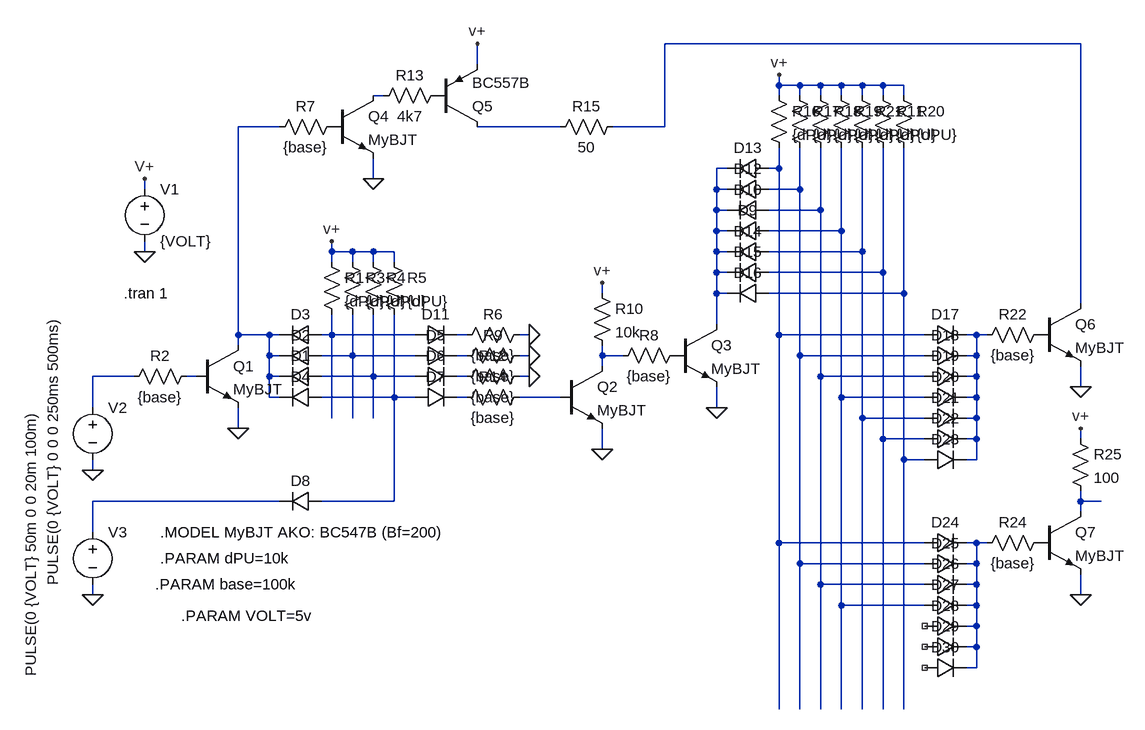
[diagram p0: schematic LoadTest.asc]
LoadTest.asc, the LTspice schematic file:
Version 4
SHEET 1 1704 1188
WIRE 1664 -224 1024 -224
WIRE 736 -192 736 -224
WIRE 1200 -160 1200 -176
WIRE 1232 -160 1200 -160
WIRE 1264 -160 1232 -160
WIRE 1296 -160 1264 -160
WIRE 1328 -160 1296 -160
WIRE 1360 -160 1328 -160
WIRE 1392 -160 1360 -160
WIRE 592 -144 576 -144
WIRE 1200 -144 1200 -160
WIRE 1232 -144 1232 -160
WIRE 1264 -144 1264 -160
WIRE 1296 -144 1296 -160
WIRE 1328 -144 1328 -160
WIRE 1360 -144 1360 -160
WIRE 1392 -144 1392 -160
WIRE 432 -96 368 -96
WIRE 864 -96 736 -96
WIRE 1024 -96 1024 -224
WIRE 1024 -96 944 -96
WIRE 1120 -32 1104 -32
WIRE 1200 -32 1200 -64
WIRE 1200 -32 1184 -32
WIRE 576 -16 576 -48
WIRE 224 0 224 -16
WIRE 1104 0 1104 -32
WIRE 1120 0 1104 0
WIRE 1232 0 1232 -64
WIRE 1232 0 1184 0
WIRE 1104 32 1104 0
WIRE 1120 32 1104 32
WIRE 1264 32 1264 -64
WIRE 1264 32 1184 32
WIRE 1104 64 1104 32
WIRE 1120 64 1104 64
WIRE 1296 64 1296 -64
WIRE 1296 64 1184 64
WIRE 224 96 224 80
WIRE 512 96 512 80
WIRE 544 96 512 96
WIRE 576 96 544 96
WIRE 608 96 576 96
WIRE 1104 96 1104 64
WIRE 1120 96 1104 96
WIRE 1328 96 1328 -64
WIRE 1328 96 1184 96
WIRE 512 112 512 96
WIRE 544 112 544 96
WIRE 576 112 576 96
WIRE 608 112 608 96
WIRE 1104 128 1104 96
WIRE 1120 128 1104 128
WIRE 1360 128 1360 -64
WIRE 1360 128 1184 128
WIRE 928 160 928 144
WIRE 1104 160 1104 128
WIRE 1120 160 1104 160
WIRE 1392 160 1392 -64
WIRE 1392 160 1184 160
WIRE 1664 176 1664 -224
WIRE 1104 208 1104 160
WIRE 368 224 368 -96
WIRE 416 224 368 224
WIRE 432 224 416 224
WIRE 512 224 512 192
WIRE 512 224 496 224
WIRE 640 224 512 224
WIRE 720 224 704 224
WIRE 816 224 800 224
WIRE 1200 224 1200 -32
WIRE 1424 224 1200 224
WIRE 1504 224 1488 224
WIRE 1520 224 1504 224
WIRE 368 240 368 224
WIRE 416 256 416 224
WIRE 432 256 416 256
WIRE 544 256 544 192
WIRE 544 256 496 256
WIRE 640 256 544 256
WIRE 720 256 704 256
WIRE 816 256 800 256
WIRE 928 256 928 240
WIRE 960 256 928 256
WIRE 1232 256 1232 0
WIRE 1424 256 1232 256
WIRE 1504 256 1504 224
WIRE 1504 256 1488 256
WIRE 928 272 928 256
WIRE 208 288 144 288
WIRE 304 288 288 288
WIRE 416 288 416 256
WIRE 432 288 416 288
WIRE 576 288 576 192
WIRE 576 288 496 288
WIRE 640 288 576 288
WIRE 720 288 704 288
WIRE 816 288 800 288
WIRE 1264 288 1264 32
WIRE 1424 288 1264 288
WIRE 1504 288 1504 256
WIRE 1504 288 1488 288
WIRE 1664 304 1664 272
WIRE 416 320 416 288
WIRE 432 320 416 320
WIRE 608 320 608 192
WIRE 608 320 496 320
WIRE 640 320 608 320
WIRE 720 320 704 320
WIRE 864 320 800 320
WIRE 1296 320 1296 64
WIRE 1424 320 1296 320
WIRE 1504 320 1504 288
WIRE 1504 320 1488 320
WIRE 144 336 144 288
WIRE 1104 336 1104 304
WIRE 512 352 512 224
WIRE 544 352 544 256
WIRE 576 352 576 288
WIRE 1328 352 1328 96
WIRE 1424 352 1328 352
WIRE 1504 352 1504 320
WIRE 1504 352 1488 352
WIRE 368 368 368 336
WIRE 1360 384 1360 128
WIRE 1424 384 1360 384
WIRE 1504 384 1504 352
WIRE 1504 384 1488 384
WIRE 1664 384 1664 368
WIRE 928 400 928 368
WIRE 1392 416 1392 160
WIRE 1424 416 1392 416
WIRE 1504 416 1504 384
WIRE 1504 416 1488 416
WIRE 144 432 144 416
WIRE 432 480 144 480
WIRE 608 480 608 320
WIRE 608 480 496 480
WIRE 1664 480 1664 464
WIRE 1696 480 1664 480
WIRE 1664 496 1664 480
WIRE 144 528 144 480
WIRE 1200 544 1200 224
WIRE 1424 544 1200 544
WIRE 1504 544 1488 544
WIRE 1520 544 1504 544
WIRE 1232 576 1232 256
WIRE 1424 576 1232 576
WIRE 1504 576 1504 544
WIRE 1504 576 1488 576
WIRE 1264 608 1264 288
WIRE 1424 608 1264 608
WIRE 1504 608 1504 576
WIRE 1504 608 1488 608
WIRE 144 624 144 608
WIRE 1664 624 1664 592
WIRE 1296 640 1296 320
WIRE 1424 640 1296 640
WIRE 1504 640 1504 608
WIRE 1504 640 1488 640
WIRE 1504 672 1504 640
WIRE 1504 672 1488 672
WIRE 1504 704 1504 672
WIRE 1504 704 1488 704
WIRE 1504 736 1504 704
WIRE 1504 736 1488 736
WIRE 1200 800 1200 544
WIRE 1232 800 1232 576
WIRE 1264 800 1264 608
WIRE 1296 800 1296 640
WIRE 1328 800 1328 352
WIRE 1360 800 1360 384
WIRE 1392 800 1392 416
FLAG 224 96 0
FLAG 224 -16 V+
FLAG 368 368 0
FLAG 512 80 v+
FLAG 144 432 0
FLAG 928 400 0
FLAG 928 144 v+
FLAG 1104 336 0
FLAG 576 -16 0
FLAG 736 -224 v+
FLAG 816 224 0
FLAG 816 256 0
FLAG 816 288 0
FLAG 144 624 0
FLAG 1200 -176 v+
FLAG 1664 304 0
FLAG 1664 624 0
FLAG 1664 368 v+
SYMBOL voltage 224 -16 R0
SYMATTR InstName V1
SYMATTR Value {VOLT}
SYMBOL res 192 304 R270
WINDOW 0 32 56 VTop 2
WINDOW 3 0 56 VBottom 2
SYMATTR InstName R2
SYMATTR Value {base}
SYMBOL voltage 144 320 R0
WINDOW 3 -61 -125 VRight 2
SYMATTR InstName V2
SYMATTR Value PULSE(0 {VOLT} 0 0 0 250ms 500ms)
SYMBOL diode 496 304 R90
WINDOW 0 0 32 VBottom 2
WINDOW 3 32 32 Invisible 2
SYMATTR InstName D4
SYMATTR Value 1N914
SYMBOL res 496 96 R0
SYMATTR InstName R1
SYMATTR Value {dPU}
SYMBOL npn 304 240 R0
SYMATTR InstName Q1
SYMATTR Value MyBJT
SYMBOL npn 864 272 R0
SYMATTR InstName Q2
SYMATTR Value MyBJT
SYMBOL res 912 144 R0
SYMATTR InstName R10
SYMATTR Value 10k
SYMBOL npn 1040 208 R0
SYMATTR InstName Q3
SYMATTR Value MyBJT
SYMBOL res 688 -160 R90
WINDOW 0 0 56 VBottom 2
WINDOW 3 32 56 VTop 2
SYMATTR InstName R13
SYMATTR Value 4k7
SYMBOL npn 512 -144 R0
SYMATTR InstName Q4
SYMATTR Value MyBJT
SYMBOL pnp 672 -96 M180
SYMATTR InstName Q5
SYMATTR Value BC557B
SYMBOL res 848 -80 R270
WINDOW 0 32 56 VTop 2
WINDOW 3 0 56 VBottom 2
SYMATTR InstName R15
SYMATTR Value 50
SYMBOL diode 640 240 R270
WINDOW 0 32 32 VTop 2
WINDOW 3 0 32 Invisible 2
SYMATTR InstName D11
SYMATTR Value 1N914
SYMBOL diode 496 272 R90
WINDOW 0 0 32 VBottom 2
WINDOW 3 32 32 Invisible 2
SYMATTR InstName D1
SYMATTR Value 1N914
SYMBOL diode 496 240 R90
WINDOW 0 0 32 VBottom 2
WINDOW 3 32 32 Invisible 2
SYMATTR InstName D2
SYMATTR Value 1N914
SYMBOL diode 496 208 R90
WINDOW 0 0 32 VBottom 2
WINDOW 3 32 32 Invisible 2
SYMATTR InstName D3
SYMATTR Value 1N914
SYMBOL diode 640 272 R270
WINDOW 0 32 32 VTop 2
WINDOW 3 0 32 Invisible 2
SYMATTR InstName D5
SYMATTR Value 1N914
SYMBOL diode 640 304 R270
WINDOW 0 32 32 VTop 2
WINDOW 3 0 32 Invisible 2
SYMATTR InstName D6
SYMATTR Value 1N914
SYMBOL diode 640 336 R270
WINDOW 0 32 32 VTop 2
WINDOW 3 0 32 Invisible 2
SYMATTR InstName D7
SYMATTR Value 1N914
SYMBOL diode 496 464 R90
WINDOW 0 0 32 VBottom 2
WINDOW 3 32 32 Invisible 2
SYMATTR InstName D8
SYMATTR Value 1N914
SYMBOL voltage 144 512 R0
WINDOW 3 -95 -173 VRight 2
SYMATTR InstName V3
SYMATTR Value PULSE(0 {VOLT} 50m 0 0 20m 100m)
SYMBOL res 416 -80 R270
WINDOW 0 32 56 VTop 2
WINDOW 3 0 56 VBottom 2
SYMATTR InstName R7
SYMATTR Value {base}
SYMBOL res 944 272 R270
WINDOW 0 32 56 VTop 2
WINDOW 3 0 56 VBottom 2
SYMATTR InstName R8
SYMATTR Value {base}
SYMBOL res 704 240 R270
WINDOW 0 32 56 VTop 2
WINDOW 3 0 56 VBottom 2
SYMATTR InstName R6
SYMATTR Value {base}
SYMBOL res 704 272 R270
WINDOW 0 32 56 VTop 2
WINDOW 3 0 56 VBottom 2
SYMATTR InstName R9
SYMATTR Value {base}
SYMBOL res 704 304 R270
WINDOW 0 32 56 VTop 2
WINDOW 3 0 56 VBottom 2
SYMATTR InstName R12
SYMATTR Value {base}
SYMBOL res 704 336 R270
WINDOW 0 32 56 VTop 2
WINDOW 3 0 56 VBottom 2
SYMATTR InstName R14
SYMATTR Value {base}
SYMBOL res 528 96 R0
SYMATTR InstName R3
SYMATTR Value {dPU}
SYMBOL res 560 96 R0
SYMATTR InstName R4
SYMATTR Value {dPU}
SYMBOL res 592 96 R0
SYMATTR InstName R5
SYMATTR Value {dPU}
SYMBOL diode 1184 48 R90
WINDOW 0 0 32 VBottom 2
WINDOW 3 32 32 Invisible 2
SYMATTR InstName D9
SYMATTR Value 1N914
SYMBOL res 1184 -160 R0
SYMATTR InstName R16
SYMATTR Value {dPU}
SYMBOL diode 1184 16 R90
WINDOW 0 0 32 VBottom 2
WINDOW 3 32 32 Invisible 2
SYMATTR InstName D10
SYMATTR Value 1N914
SYMBOL diode 1184 -16 R90
WINDOW 0 0 32 VBottom 2
WINDOW 3 32 32 Invisible 2
SYMATTR InstName D12
SYMATTR Value 1N914
SYMBOL diode 1184 -48 R90
WINDOW 0 0 32 VBottom 2
WINDOW 3 32 32 Invisible 2
SYMATTR InstName D13
SYMATTR Value 1N914
SYMBOL res 1216 -160 R0
SYMATTR InstName R17
SYMATTR Value {dPU}
SYMBOL res 1248 -160 R0
SYMATTR InstName R18
SYMATTR Value {dPU}
SYMBOL res 1280 -160 R0
SYMATTR InstName R19
SYMATTR Value {dPU}
SYMBOL res 1344 -160 R0
SYMATTR InstName R11
SYMATTR Value {dPU}
SYMBOL res 1376 -160 R0
SYMATTR InstName R20
SYMATTR Value {dPU}
SYMBOL res 1312 -160 R0
SYMATTR InstName R21
SYMATTR Value {dPU}
SYMBOL diode 1184 80 R90
WINDOW 0 0 32 VBottom 2
WINDOW 3 32 32 Invisible 2
SYMATTR InstName D14
SYMATTR Value 1N914
SYMBOL diode 1184 112 R90
WINDOW 0 0 32 VBottom 2
WINDOW 3 32 32 Invisible 2
SYMATTR InstName D15
SYMATTR Value 1N914
SYMBOL diode 1184 144 R90
WINDOW 0 0 32 VBottom 2
WINDOW 3 32 32 Invisible 2
SYMATTR InstName D16
SYMATTR Value 1N914
SYMBOL diode 1424 240 R270
WINDOW 0 32 32 VTop 2
WINDOW 3 0 32 Invisible 2
SYMATTR InstName D17
SYMATTR Value 1N914
SYMBOL diode 1424 272 R270
WINDOW 0 32 32 VTop 2
WINDOW 3 0 32 Invisible 2
SYMATTR InstName D18
SYMATTR Value 1N914
SYMBOL diode 1424 304 R270
WINDOW 0 32 32 VTop 2
WINDOW 3 0 32 Invisible 2
SYMATTR InstName D19
SYMATTR Value 1N914
SYMBOL diode 1424 336 R270
WINDOW 0 32 32 VTop 2
WINDOW 3 0 32 Invisible 2
SYMATTR InstName D20
SYMATTR Value 1N914
SYMBOL res 1504 240 R270
WINDOW 0 32 56 VTop 2
WINDOW 3 0 56 VBottom 2
SYMATTR InstName R22
SYMATTR Value {base}
SYMBOL diode 1424 368 R270
WINDOW 0 32 32 VTop 2
WINDOW 3 0 32 Invisible 2
SYMATTR InstName D21
SYMATTR Value 1N914
SYMBOL diode 1424 400 R270
WINDOW 0 32 32 VTop 2
WINDOW 3 0 32 Invisible 2
SYMATTR InstName D22
SYMATTR Value 1N914
SYMBOL diode 1424 432 R270
WINDOW 0 32 32 VTop 2
WINDOW 3 0 32 Invisible 2
SYMATTR InstName D23
SYMATTR Value 1N914
SYMBOL npn 1600 176 R0
SYMATTR InstName Q6
SYMATTR Value MyBJT
SYMBOL diode 1424 560 R270
WINDOW 0 32 32 VTop 2
WINDOW 3 0 32 Invisible 2
SYMATTR InstName D24
SYMATTR Value 1N914
SYMBOL diode 1424 592 R270
WINDOW 0 32 32 VTop 2
WINDOW 3 0 32 Invisible 2
SYMATTR InstName D25
SYMATTR Value 1N914
SYMBOL diode 1424 624 R270
WINDOW 0 32 32 VTop 2
WINDOW 3 0 32 Invisible 2
SYMATTR InstName D26
SYMATTR Value 1N914
SYMBOL diode 1424 656 R270
WINDOW 0 32 32 VTop 2
WINDOW 3 0 32 Invisible 2
SYMATTR InstName D27
SYMATTR Value 1N914
SYMBOL res 1504 560 R270
WINDOW 0 32 56 VTop 2
WINDOW 3 0 56 VBottom 2
SYMATTR InstName R24
SYMATTR Value {base}
SYMBOL diode 1424 688 R270
WINDOW 0 32 32 VTop 2
WINDOW 3 0 32 Invisible 2
SYMATTR InstName D28
SYMATTR Value 1N914
SYMBOL diode 1424 720 R270
WINDOW 0 32 32 VTop 2
WINDOW 3 0 32 Invisible 2
SYMATTR InstName D29
SYMATTR Value 1N914
SYMBOL diode 1424 752 R270
WINDOW 0 32 32 VTop 2
WINDOW 3 0 32 Invisible 2
SYMATTR InstName D30
SYMATTR Value 1N914
SYMBOL npn 1600 496 R0
SYMATTR InstName Q7
SYMATTR Value MyBJT
SYMBOL res 1648 368 R0
SYMATTR InstName R25
SYMATTR Value 100
TEXT 192 160 Left 2 !.tran 1
TEXT 248 528 Left 2 !.MODEL MyBJT AKO: BC547B (Bf=200)
TEXT 240 608 Left 2 !.PARAM base=100k
TEXT 248 568 Left 2 !.PARAM dPU=10k
TEXT 280 656 Left 2 !.PARAM VOLT=5v

The netlist it stands for:
* LoadTest.asc
V1 V+ 0 {VOLT}
R2 N019 N020 {base}
V2 N019 0 PULSE(0 {VOLT} 0 0 0 250ms 500ms)
D4 N023 N003 1N914
R1 V+ N013 {dPU}
Q1 N003 N020 0 0 MyBJT
Q2 N018 N025 0 0 MyBJT
R10 V+ N018 10k
Q3 N005 P001 0 0 MyBJT
R13 P002 N002 4k7
Q4 N002 P003 0 0 MyBJT
Q5 N004 P002 V+ 0 BC557B
R15 N004 N001 50
D11 N013 N014 1N914
D1 N021 N003 1N914
D2 N016 N003 1N914
D3 N013 N003 1N914
D5 N016 N017 1N914
D6 N021 N022 1N914
D7 N023 N024 1N914
D8 N023 N026 1N914
V3 N026 0 PULSE(0 {VOLT} 50m 0 0 20m 100m)
R7 N003 P003 {base}
R8 N018 P001 {base}
R6 N014 0 {base}
R9 N017 0 {base}
R12 N022 0 {base}
R14 N024 N025 {base}
R3 V+ N016 {dPU}
R4 V+ N021 {dPU}
R5 V+ N023 {dPU}
D9 N009 N005 1N914
R16 V+ N006 {dPU}
D10 N008 N005 1N914
D12 N007 N005 1N914
D13 N006 N005 1N914
R17 V+ N007 {dPU}
R18 V+ N008 {dPU}
R19 V+ N009 {dPU}
R11 V+ N011 {dPU}
R20 V+ N012 {dPU}
R21 V+ N010 {dPU}
D14 N010 N005 1N914
D15 N011 N005 1N914
D16 N012 N005 1N914
D17 N006 N015 1N914
D18 N007 N015 1N914
D19 N008 N015 1N914
D20 N009 N015 1N914
R22 N015 P004 {base}
D21 N010 N015 1N914
D22 N011 N015 1N914
D23 N012 N015 1N914
Q6 N001 P004 0 0 MyBJT
D24 N006 N028 1N914
D25 N007 N028 1N914
D26 N008 N028 1N914
D27 N009 N028 1N914
R24 N028 P005 {base}
D28 NC_01 N028 1N914
D29 NC_02 N028 1N914
D30 NC_03 N028 1N914
Q7 N027 P005 0 0 MyBJT
R25 V+ N027 100
.model D D
.lib standard.dio
.model NPN NPN
.model PNP PNP
.lib standard.bjt
.tran 1
.MODEL MyBJT AKO: BC547B (Bf=200)
.PARAM base=100k
.PARAM dPU=10k
.PARAM VOLT=5v
.backanno
.end